# EAGLE schematic Main Wiring Harness New 2018 (EAGLE 8.3.1)
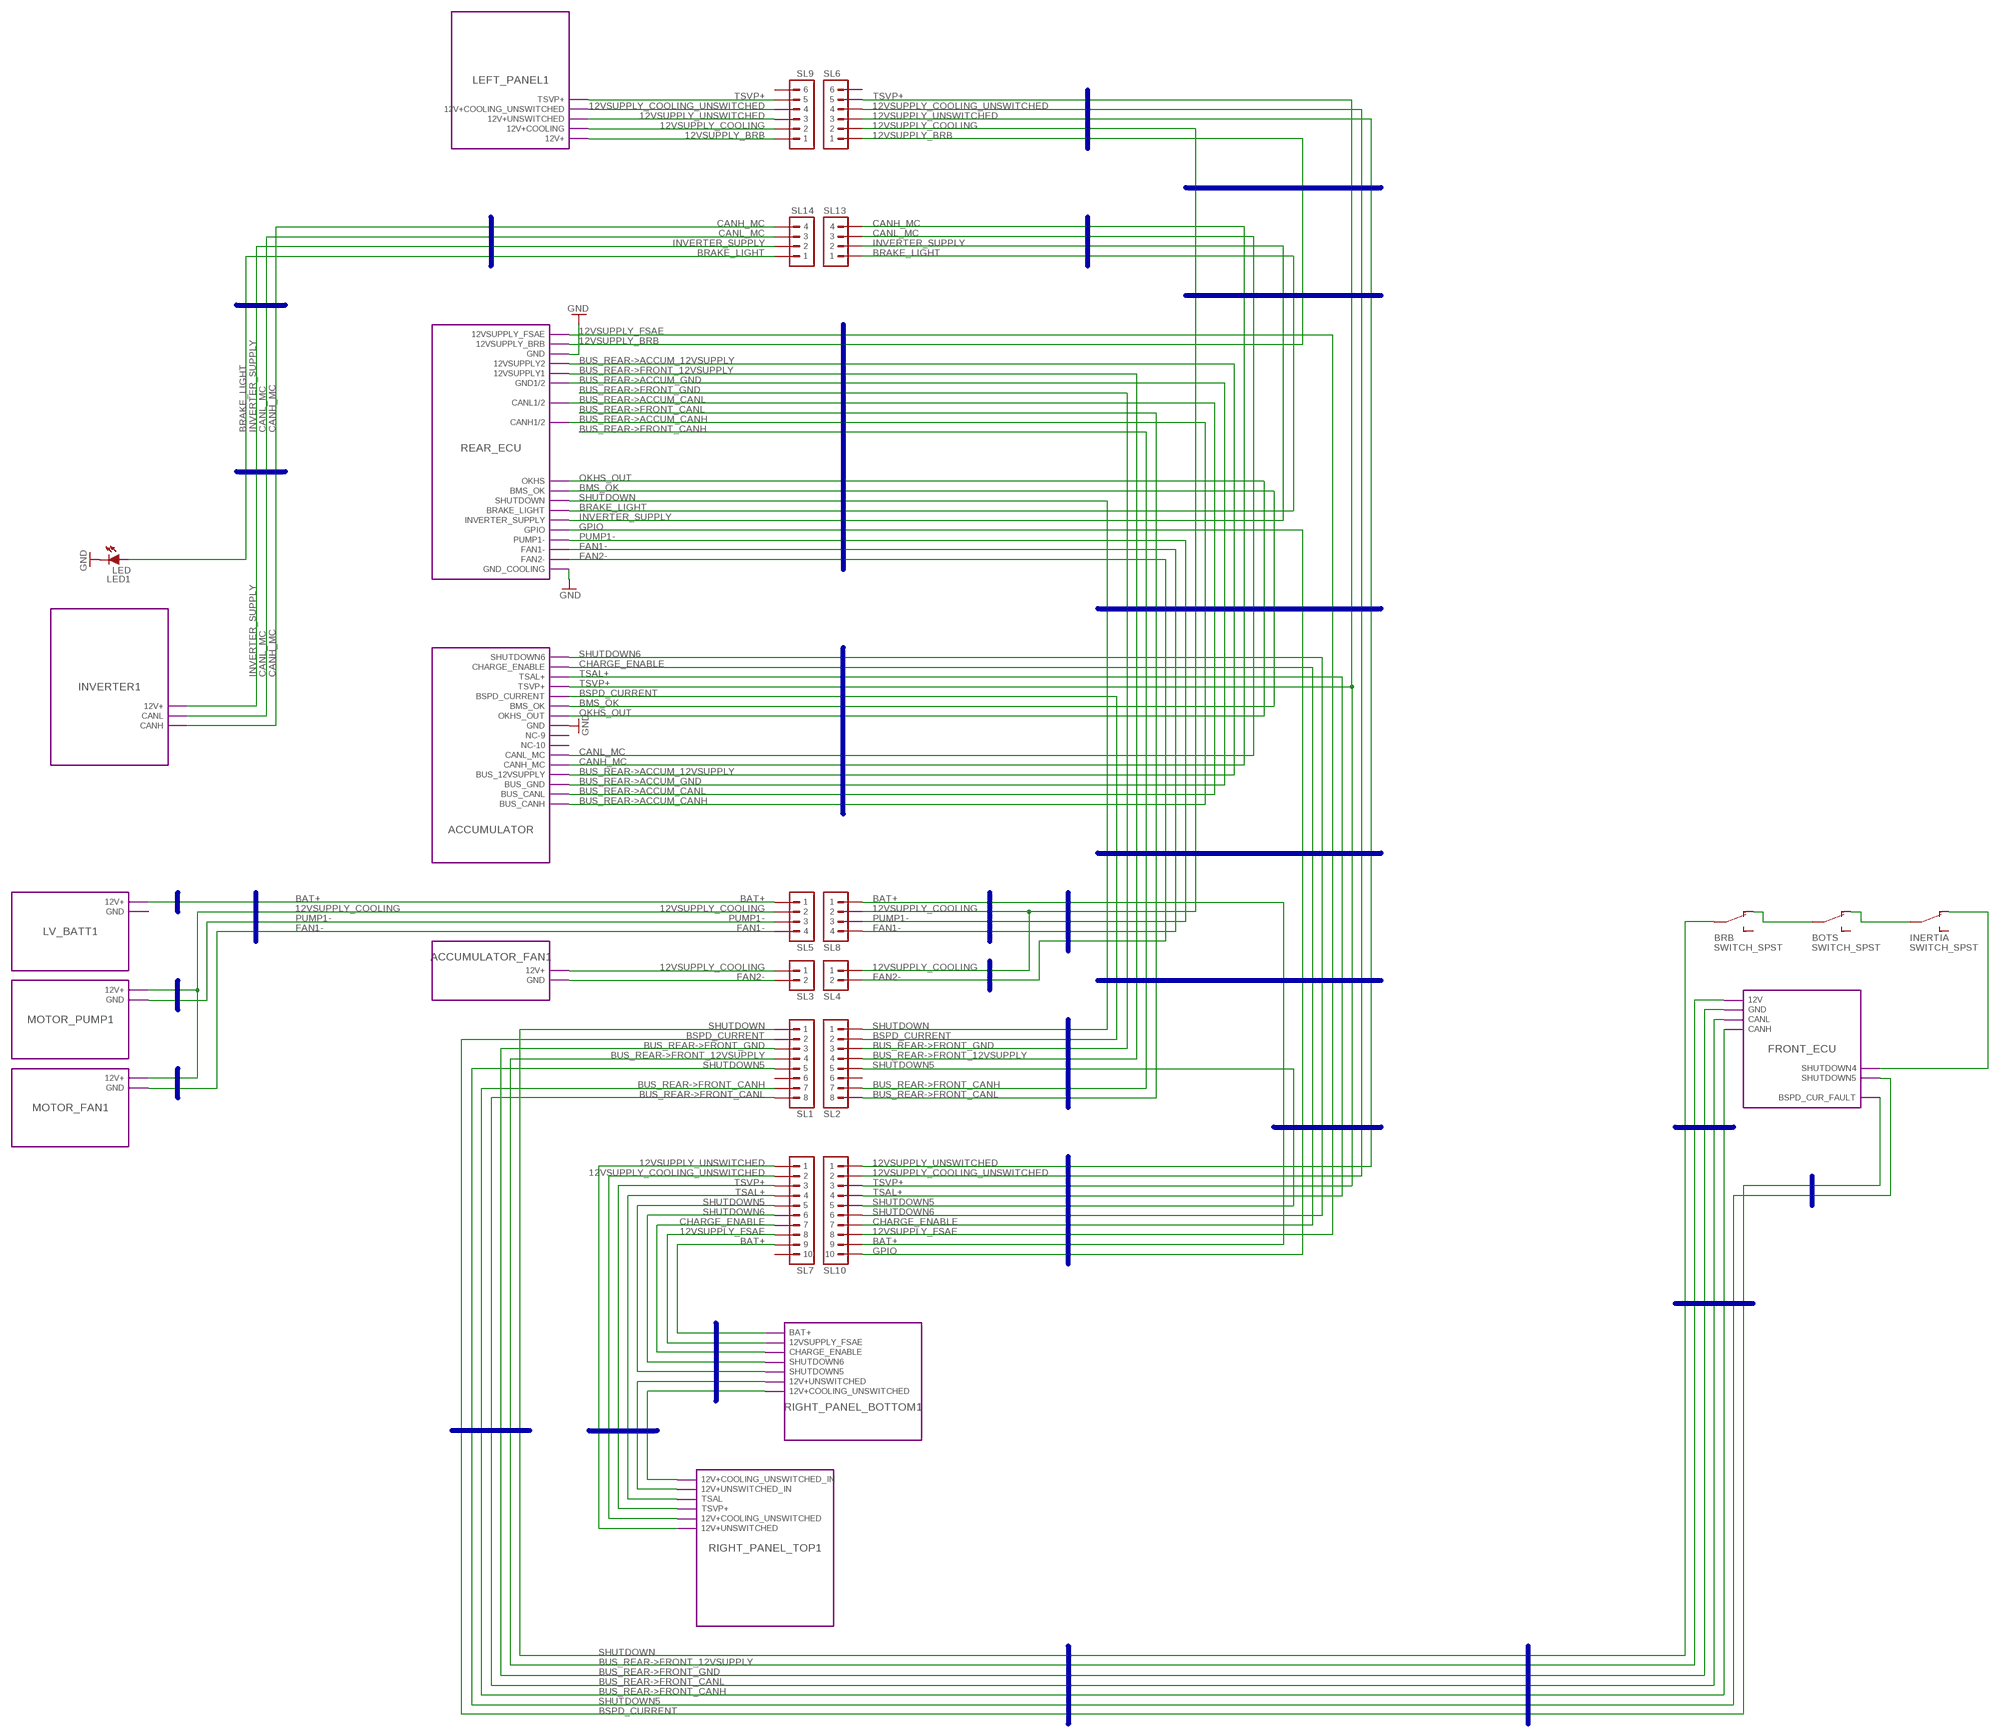
[diagram p0: schematic, sheet 1]

## Parts
BOTS  SWITCH_SPST  (no package)
BRB  SWITCH_SPST  (no package)
INERTIA  SWITCH_SPST  (no package)
LED1  LED  (no package)
SL1  M08  (no package)
SL2  M08  (no package)
SL3  M02  (no package)
SL4  M02  (no package)
SL5  M04  (no package)
SL6  M06  (no package)
SL7  M10  (no package)
SL8  M04  (no package)
SL9  M06  (no package)
SL10  M10  (no package)
SL13  M04  (no package)
SL14  M04  (no package)

## Module instances
ACCUMULATOR = ACCUMULATOR
REAR_ECU = PCU
INVERTER1 = INVERTER
LEFT_PANEL1 = LEFT_PANEL
RIGHT_PANEL_BOTTOM1 = RIGHT_PANEL_BOTTOM
RIGHT_PANEL_TOP1 = RIGHT_PANEL_TOP
FRONT_ECU = FCU
LV_BATT1 = LV_BATT
MOTOR_PUMP1 = MOTOR_PUMP
MOTOR_FAN1 = MOTOR_FAN
ACCUMULATOR_FAN1 = ACCUMULATOR_FAN

## Nets
12VSUPPLY_BRB: SL6.1 SL9.1 ; port REAR_ECU.12VSUPPLY_BRB LEFT_PANEL1.12V+
12VSUPPLY_COOLING: SL3.1 SL4.1 SL5.2 SL6.2 SL8.2 SL9.2 ; port MOTOR_FAN1.12V+ MOTOR_PUMP1.12V+ LEFT_PANEL1.12V+COOLING ACCUMULATOR_FAN1.12V+
12VSUPPLY_COOLING_UNSWITCHED: SL6.4 SL7.2 SL9.4 SL10.2 ; port RIGHT_PANEL_TOP1.12V+COOLING_UNSWITCHED LEFT_PANEL1.12V+COOLING_UNSWITCHED
12VSUPPLY_FSAE: SL7.8 SL10.8 ; port RIGHT_PANEL_BOTTOM1.12VSUPPLY_FSAE REAR_ECU.12VSUPPLY_FSAE
12VSUPPLY_UNSWITCHED: SL6.3 SL7.1 SL9.3 SL10.1 ; port RIGHT_PANEL_TOP1.12V+UNSWITCHED LEFT_PANEL1.12V+UNSWITCHED
BAT+: SL5.1 SL7.9 SL8.1 SL10.9 ; port LV_BATT1.12V+ RIGHT_PANEL_BOTTOM1.BAT+
BMS_OK: port REAR_ECU.BMS_OK ACCUMULATOR.BMS_OK
BRAKE_LIGHT: LED1.A SL13.1 SL14.1 ; port REAR_ECU.BRAKE_LIGHT
BSPD_CURRENT: SL1.2 SL2.2 ; port FRONT_ECU.BSPD_CUR_FAULT ACCUMULATOR.BSPD_CURRENT
BUS_REAR->ACCUM_12VSUPPLY: port ACCUMULATOR.BUS_12VSUPPLY REAR_ECU.12VSUPPLY2
BUS_REAR->ACCUM_CANH: port ACCUMULATOR.BUS_CANH REAR_ECU.CANH1/2
BUS_REAR->ACCUM_CANL: port ACCUMULATOR.BUS_CANL REAR_ECU.CANL1/2
BUS_REAR->ACCUM_GND: port ACCUMULATOR.BUS_GND REAR_ECU.GND1/2
BUS_REAR->FRONT_12VSUPPLY: SL1.4 SL2.4 ; port FRONT_ECU.12V REAR_ECU.12VSUPPLY1
BUS_REAR->FRONT_CANH: SL1.7 SL2.7 ; port FRONT_ECU.CANH
BUS_REAR->FRONT_CANL: SL1.8 SL2.8 ; port FRONT_ECU.CANL
BUS_REAR->FRONT_GND: SL1.3 SL2.3 ; port FRONT_ECU.GND
CANH_MC: SL13.4 SL14.4 ; port INVERTER1.CANH ACCUMULATOR.CANH_MC
CANL_MC: SL13.3 SL14.3 ; port INVERTER1.CANL ACCUMULATOR.CANL_MC
CHARGE_ENABLE: SL7.7 SL10.7 ; port RIGHT_PANEL_BOTTOM1.CHARGE_ENABLE ACCUMULATOR.CHARGE_ENABLE
FAN1-: SL5.4 SL8.4 ; port MOTOR_FAN1.GND REAR_ECU.FAN1-
FAN2-: SL3.2 SL4.2 ; port REAR_ECU.FAN2- ACCUMULATOR_FAN1.GND
GND: LED1.C ; port ACCUMULATOR.GND REAR_ECU.GND_COOLING REAR_ECU.GND
GPIO: SL10.10 ; port REAR_ECU.GPIO
INVERTER_SUPPLY: SL13.2 SL14.2 ; port INVERTER1.12V+ REAR_ECU.INVERTER_SUPPLY
N$1: BOTS.P BRB.O
N$2: BOTS.O INERTIA.P
N$3: INERTIA.O ; port FRONT_ECU.SHUTDOWN4
N$43: port RIGHT_PANEL_TOP1.12V+COOLING_UNSWITCHED_IN RIGHT_PANEL_BOTTOM1.12V+COOLING_UNSWITCHED
N$46: port RIGHT_PANEL_TOP1.12V+UNSWITCHED_IN RIGHT_PANEL_BOTTOM1.12V+UNSWITCHED
OKHS_OUT: port ACCUMULATOR.OKHS_OUT REAR_ECU.OKHS
PUMP1-: SL5.3 SL8.3 ; port MOTOR_PUMP1.GND REAR_ECU.PUMP1-
SHUTDOWN: BRB.P SL1.1 SL2.1 ; port REAR_ECU.SHUTDOWN
SHUTDOWN5: SL1.5 SL2.5 SL7.5 SL10.5 ; port RIGHT_PANEL_BOTTOM1.SHUTDOWN5 FRONT_ECU.SHUTDOWN5
SHUTDOWN6: SL7.6 SL10.6 ; port RIGHT_PANEL_BOTTOM1.SHUTDOWN6 ACCUMULATOR.SHUTDOWN6
TSAL+: SL7.4 SL10.4 ; port RIGHT_PANEL_TOP1.TSAL ACCUMULATOR.TSAL+
TSVP+: SL6.5 SL7.3 SL9.5 SL10.3 ; port RIGHT_PANEL_TOP1.TSVP+ ACCUMULATOR.TSVP+ LEFT_PANEL1.TSVP+
Unconnected: BOTS.S BRB.S INERTIA.S SL1.6 SL2.6 SL6.6 SL7.10 SL9.6

## Buses
B$1
B$4
B$9
B$14
B$19
B$20
B$21
B$22
B$23
B$24
B$25
B$28
B$31
B$32
B$35
B$36
B$37
B$12
B$40

## Library data of the parts
BOTS BRB INERTIA = HyTechSymbols:SWITCH_SPST: Single Pull Single Throw Switch
LED1 = HyTechSymbols:LED: Generic LED
SL1 SL2 = HyTechSymbols:M08: Generic 8-pin connector
SL3 SL4 = HyTechSymbols:M02: Generic 2-pin connector
SL5 SL8 SL13 SL14 = HyTechSymbols:M04: Generic 4-pin connector
SL6 SL9 = HyTechSymbols:M06: Generic 6-pin connector
SL7 SL10 = HyTechSymbols:M10: Generic 10-pin connector

## Module ACCUMULATOR
Ports: SHUTDOWN6(in) CHARGE_ENABLE(out) TSAL+(out) TSVP+(out) BSPD_CURRENT(out) BMS_OK(out) OKHS_OUT(out) CANL_MC(io) CANH_MC(io) NC-9(nc) NC-10(nc) GND(out) BUS_GND(out) BUS_CANL(io) BUS_CANH(io) BUS_12VSUPPLY(in)

### Library data of the parts

## Module PCU
Ports: OKHS(in) BMS_OK(in) SHUTDOWN(out) BRAKE_LIGHT(out) INVERTER_SUPPLY(out) GPIO(io) GND(out) 12VSUPPLY_FSAE(in) 12VSUPPLY_BRB(in) 12VSUPPLY2(out) 12VSUPPLY1(out) GND1/2(in) CANL1/2(io) CANH1/2(io) PUMP1-(in) FAN1-(in) FAN2-(in) GND_COOLING(out)

### Library data of the parts

## Module TCU
Ports: CANH1(io) CANL1(io) 12V+1(in) GND1(out) SHUTDOWN5(out) BSPD_CUR_FAULT(in) SHUTDOWN3(in)

### Library data of the parts

## Module DCU
Ports: GND1(out) 12V+2(out) 12V+1(in) GND2(in) CANL1(io) CANH1(io) CANL2(io) CANH2(io)

### Library data of the parts

## Module COOLING
Ports: GND1(out) 12V+1(in) CANH1(io) CANL1(io) CANL2(io) CANH2(io) 12V+2(out) GND2(in) FAN1-(in) FAN2-(in) FAN3-(in) FANGND1(out) FANGND2(out) FANGND3(out) NC5(nc) 5V(in) PULSE(in) GND(out)

### Library data of the parts

## Module INVERTER
Ports: CANL(io) CANH(io) 12V+(in)

### Library data of the parts

## Module LEFT_PANEL
Ports: TSVP+(in) 12V+COOLING_UNSWITCHED(in) 12V+UNSWITCHED(in) 12V+(out) 12V+COOLING(out)

### Library data of the parts

## Module RIGHT_PANEL_BOTTOM
Ports: SHUTDOWN5(in) SHUTDOWN6(out) CHARGE_ENABLE(in) 12V+COOLING_UNSWITCHED(out) 12V+UNSWITCHED(out) BAT+(in) 12VSUPPLY_FSAE(out)

### Library data of the parts

## Module RIGHT_PANEL_TOP
Ports: TSVP+(in) 12V+COOLING_UNSWITCHED(out) 12V+UNSWITCHED(out) TSAL(in) 12V+COOLING_UNSWITCHED_IN(in) 12V+UNSWITCHED_IN(in)

### Library data of the parts

## Module FCU
Ports: 12V(in) GND(out) CANL(io) CANH(io) BSPD_CUR_FAULT(in) SHUTDOWN5(out) SHUTDOWN4(in)

### Library data of the parts

## Module LV_BATT
Ports: 12V+(out) GND(in)

### Library data of the parts

## Module MOTOR_PUMP
Ports: 12V+(in) GND(out)

### Library data of the parts

## Module MOTOR_FAN
Ports: 12V+(in) GND(out)

### Library data of the parts

## Module ACCUMULATOR_FAN
Ports: GND(out) 12V+(in)

### Library data of the parts